# Altium schematic sheet H750Common7.SchDoc
size A3
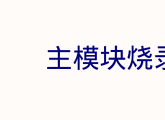
[diagram p0: H750Common7.SchDoc]

## Notes on the sheet
- 主模块烧录